# EAGLE schematic sensor_modul (EAGLE 6.4)
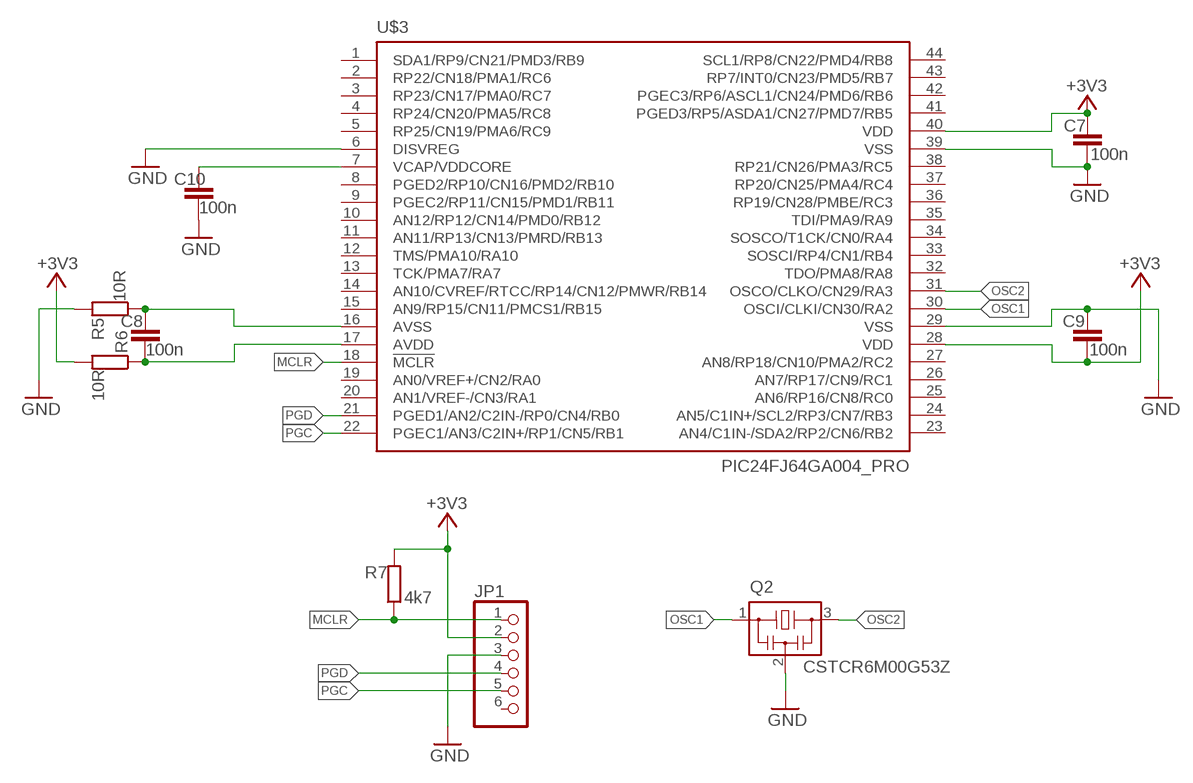
[diagram p0: schematic, sheet 1]

## Parts
C7  100n  C-EUC1206K  [C1206K]
C8  100n  C-EUC1206K  [C1206K]
C9  100n  C-EUC1206K  [C1206K]
C10  100n  C-EUC1206K  [C1206K]
JP1  PINHD-1X6  [1X06]
Q2  CSTCR6M00G53Z  [CSTER12M]
R5  10R  R-EU_M1206  [M1206]
R6  10R  R-EU_M1206  [M1206]
R7  4k7  R-EU_M1206  [M1206]
U$3  PIC24FJ64GA004_PRO  [TQFP44]

## Nets
+3V3: C7.2 C9.2 JP1.2 R6.2 R7.2 U$3.28(VDD) U$3.40(VDD)
GND: C7.1 C9.1 C10.2 JP1.3 Q2.2 R5.2 U$3.6(DISVREG) U$3.29(VSS) U$3.39(VSS)
MCLR: JP1.1 R7.1 U$3.18(!MCLR)
N$4: C8.2 R6.1 U$3.17(AVDD)
N$7: C8.1 R5.1 U$3.16(AVSS)
N$9: C10.1 U$3.7(VCAP/VDDCORE)
OSC1: Q2.1 U$3.30(OSCI/CLKI/CN30/RA2)
OSC2: Q2.3 U$3.31(OSCO/CLKO/CN29/RA3)
PGC: JP1.5 U$3.22(PGEC1/AN3/C2IN+/RP1/CN5/RB1)
PGD: JP1.4 U$3.21(PGED1/AN2/C2IN-/RP0/CN4/RB0)
Unconnected: JP1.6 U$3.1(SDA1/RP9/CN21/PMD3/RB9) U$3.2(RP22/CN18/PMA1/RC6) U$3.3(RP23/CN17/PMA0/RC7) U$3.4(RP24/CN20/PMA5/RC8) U$3.5(RP25/CN19/PMA6/RC9) U$3.8(PGED2/RP10/CN16/PMD2/RB10) U$3.9(PGEC2/RP11/CN15/PMD1/RB11) U$3.10(AN12/RP12/CN14/PMD0/RB12) U$3.11(AN11/RP13/CN13/PMRD/RB13) U$3.12(TMS/PMA10/RA10) U$3.13(TCK/PMA7/RA7) U$3.14(AN10/CVREF/RTCC/RP14/CN12/PMWR/RB14) U$3.15(AN9/RP15/CN11/PMCS1/RB15) U$3.19(AN0/VREF+/CN2/RA0) U$3.20(AN1/VREF-/CN3/RA1) U$3.23(AN4/C1IN-/SDA2/RP2/CN6/RB2) U$3.24(AN5/C1IN+/SCL2/RP3/CN7/RB3) U$3.25(AN6/RP16/CN8/RC0) U$3.26(AN7/RP17/CN9/RC1) U$3.27(AN8/RP18/CN10/PMA2/RC2) U$3.32(TDO/PMA8/RA8) U$3.33(SOSCI/RP4/CN1/RB4) U$3.34(SOSCO/T1CK/CN0/RA4) U$3.35(TDI/PMA9/RA9) U$3.36(RP19/CN28/PMBE/RC3) U$3.37(RP20/CN25/PMA4/RC4) U$3.38(RP21/CN26/PMA3/RC5) U$3.41(PGED3/RP5/ASDA1/CN27/PMD7/RB5) U$3.42(PGEC3/RP6/ASCL1/CN24/PMD6/RB6) U$3.43(RP7/INT0/CN23/PMD5/RB7) U$3.44(SCL1/RP8/CN22/PMD4/RB8)

## Library data of the parts
C7-C10 = rcl:C-EU: CAPACITOR, European symbol
JP1 = pinhead:PINHD-1X6: PIN HEADER
Q2 = cstce-resonator:CSTCR: Resonator Source: murata.co.jp; MPN: CSTCC12M0; OC_FARNELL: 1170434; OC_NEWARK: 25M8759
R5-R7 = rcl:R-EU_: RESISTOR, European symbol
U$3 = microchip:PIC24FJ64GA004_PRO